# Altium schematic sheet ZUM_Core_Power.SchDoc: ZUM Core Power
size A4; Author: Andrés Gullón; DocumentNumber: 2; SheetNumber: 2; SheetTotal: 9
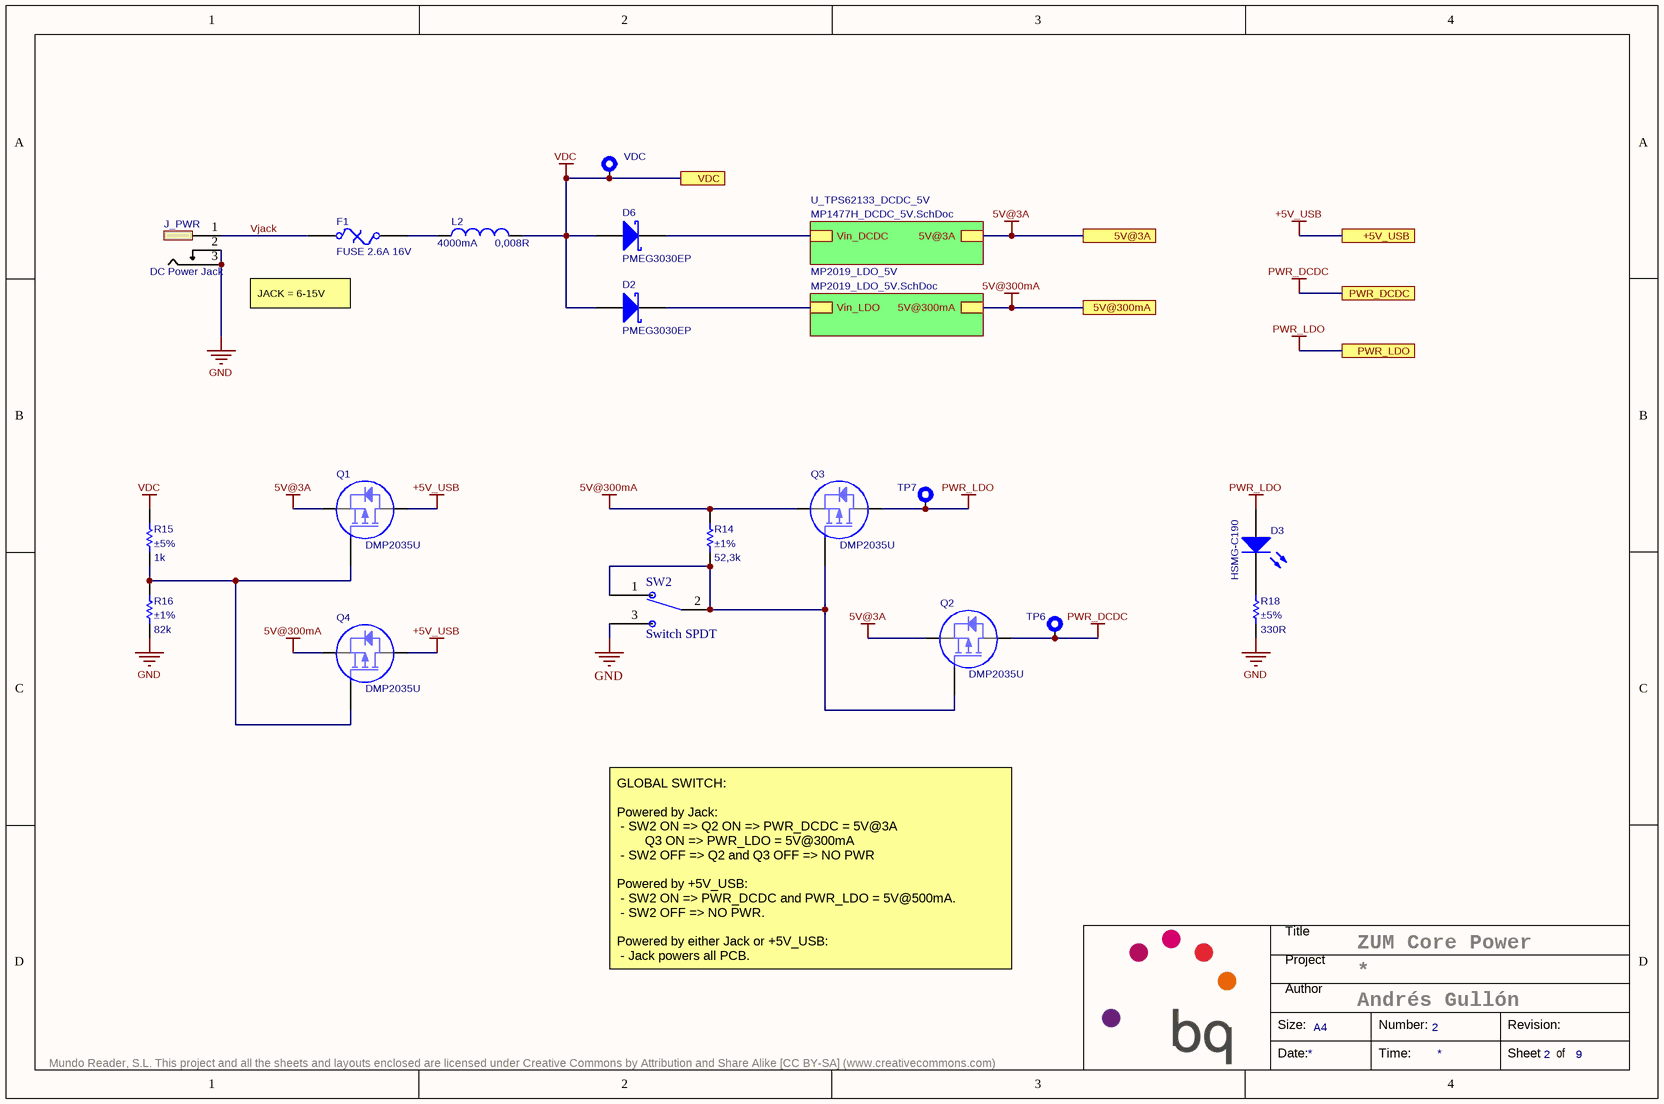
[diagram p0: ZUM_Core_Power.SchDoc]

## Parts
D2  PMEG3030EP  [SOD128]
D3  HSMG-C190  [LED0603]
D6  PMEG3030EP  [SOD128]
F1  FUSE 2.6A 16V  [F1812]
J_PWR  DC Power Jack  [Jack 2.1]
L2  Resistance_DC: 0,008R  Current: 4000mA  [L0805]  (hidden comment: L0805_33R_0,008R_4000mA)
Q1  DMP2035U  [SOT23-3]
Q2  DMP2035U  [SOT23-3]
Q3  DMP2035U  [SOT23-3]
Q4  DMP2035U  [SOT23-3]
R14  Tolerance: ±1%  Resistance: 52,3k  [R0402]  (hidden comment: R0402_52,3k_0.063W_±1%)
R15  Tolerance: ±5%  Resistance: 1k  [R0402]  (hidden comment: R0402_1k_0.063W_±5%)
R16  Tolerance: ±1%  Resistance: 82k  [R0402]  (hidden comment: R0402_82k_0.063W_±1%)
R18  Tolerance: ±5%  Resistance: 330R  [R0402]  (hidden comment: R0402_330R_0.063W_±5%)
SW2  Switch SPDT  [Slide SW SPDT Right Angle]
TP6  TP  [TP_POWER]  (value not drawn)  (no BOM)
TP7  TP  [TP_POWER]  (value not drawn)  (no BOM)
VDC  TP_POWER  [TP_POWER]  (value not drawn)  (no BOM)

## Sub-sheets
MP2019_LDO_5V = MP2019_LDO_5V.SchDoc: 5V@300mA, Vin_LDO
U_TPS62133_DCDC_5V = MP1477H_DCDC_5V.SchDoc: Vin_DCDC, 5V@3A

## Ports
5V@3A, 5V@300mA, +5V_USB, PWR_DCDC, PWR_LDO, VDC

## Nets
5V@3A: Q1.2(S) Q2.2(S) ; port 5V@3A, sheet U_TPS62133_DCDC_5V/5V@3A
5V@300mA: Q3.2(S) Q4.2(S) R14.1 ; port 5V@300mA, sheet MP2019_LDO_5V/5V@300mA
+5V_USB: Q1.3(D) Q4.3(D) ; port +5V_USB
GND: J_PWR.2 J_PWR.3 R16.1 R18.1 SW2.3
PWR_DCDC: Q2.3(D) TP6.1 ; port PWR_DCDC
PWR_LDO: D3.A Q3.3(D) TP7.1 ; port PWR_LDO
VDC: D2.A D6.A L2.2 R15.2 VDC.1 ; port VDC
Vjack: F1.1 J_PWR.1
NetD2_k: D2.k(K) ; sheet MP2019_LDO_5V/Vin_LDO
NetD3_K: D3.K R18.2
NetD6_k: D6.k(K) ; sheet U_TPS62133_DCDC_5V/Vin_DCDC
NetF1_2: F1.2 L2.1
NetQ1_1: Q1.1(G) Q4.1(G) R15.1 R16.2
NetQ2_1: Q2.1(G) Q3.1(G) R14.2 SW2.1 SW2.2

## Notes on the sheet
- JACK = 6-15V
- GLOBAL SWITCH:
  Powered by Jack:
  - SW2 ON => Q2 ON => PWR_DCDC = 5V@3A
  Q3 ON => PWR_LDO = 5V@300mA
  - SW2 OFF => Q2 and Q3 OFF => NO PWR
  Powered by +5V_USB:
  - SW2 ON => PWR_DCDC and PWR_LDO = 5V@500mA.
  - SW2 OFF => NO PWR.
  Powered by either Jack or +5V_USB:
  - Jack powers all PCB.
- Title
- Project
- Size:
- Author
- A4
- Number:
- Revision:
- Mundo Reader, S.L. This project and all the sheets and layouts enclosed are licensed under Creative Commons by Attribution and Share Alike [CC BY-SA] (www.creativecommons.com)
- Date:
- Time:
- Sheet
- of

## Library data of the parts
D2 D6 = CMP-A2309-1: Schottky Diode; Manufacturer: NXP; Ifor: 3A; Vrrm: 30V; Ifsm: 50A; Vf: 0,36V; Description ES: Diodo Schottky; Temp_Max: 150; Temp_Min: -55; Value: 3A 30V; SchLibComponentName: Schottky; Part Number: PMEG3030EP; OrderingCode: PMEG3030EP; Price units: EUR
D3 = CMP-A2544-1: LED; Manufacturer: Avago Technologies; Temp_ Max: 85; Temp_ Min: -40; OrderingCode 2: LG Q971-KN-1; Value: Green; SchLibComponentName: LED; Part Number: HSMG-C190; OrderingCode: HSMG-C190; Description ES: LED; Price units: EUR; Manufacturer 2: OSRAM Opto
F1 = CMP-A2427-2: Resettable Fuses; Part Number: FUSE 2.5A 16V; Manufacturer: Bel Fuse; SchLibComponentName: PTC_Fuse; Current: 2.5A; OrderingCode: 0ZCG0260BF2B; Description ES: Fusible reseteable; Temp_ Max: 85; Temp_ Min: -40; OrderingCode 2: MINISMDC260F/16-2; OrderingCode 3: MF-MSMF250/16X-2; Voltage: 16V; Price units: EUR; Manufacturer 2: Littelfuse; Manufacturer 3: Bourns
J_PWR = CMP-A2063-2: Connector; Manufacturer: Kycon; Idc: 5A; OrderingCode: KLDHCX0202A; Description ES: Conector; OrderingCode 2: RAPC722X; SchLibComponentName: Power_Jack; Part Number: DC Power Jack; Supplier cod: AC1190; Price units: EUR; Manufacturer 2: Switchcraft
L2 = CMP-A0714-1: Manufacturer: Würth Elektronik; SchLibComponentName: Ferrite Bead; Resistance_100MHz: 33R; OrderingCode: 742792012; Temp_ Max: 125; Temp_ Min: -55; Value: 33R 0,008R 4000mA; Part Number: L0805_33R_0,008R_4000mA; Price units: EUR
Q1-Q4 = CMP-A2378-1: P-MOSFET transistor; Manufacturer: Diodes Incorporated; SchLibComponentName: Mosfet_P; Vds: 20V; Vgss: 8V; Id: 3,6A; OrderingCode: DMP2035U-7; Description ES: Transistor MOSFET de canal P; Temp_ Max: 150; Temp_ Min: -55; Part Number: DMP2035U; Supplier cod: AC1190; Price units: EUR
R14 = CMP-A1961-1: Manufacturer: Vishay; Value: 52,3k ±1% 0.063W; OrderingCode: CRCW040252K3FK; Power: 0.063W; Temp_ Max: 155; Temp_ Min: -55; SchLibComponentName: Resistor; PackageDescription: SMD; Part Number: R0402_52,3k_0.063W_±1%; Price units: EUR
R15 = CMP-A1718-3: Manufacturer: Vishay; OrderingCode: CRCW04021K00JN; Power: 0.063W; Value: 1k ±5% 0.063W; Temp_ Max: 155; Temp_ Min: -55; Description ES: Resistencia; SchLibComponentName: Resistor; PackageDescription: SMD; Part Number: R0402_1k_0.063W_±5%; Price units: EUR
R16 = CMP-A1992-3: Manufacturer: Vishay; OrderingCode: CRCW040282K0FK; Power: 0.063W; Value: 82k ±1% 0.063W; Temp_ Max: 155; Temp_ Min: -55; Description ES: Resistencia; OrderingCode 2: RC0402FR-0782KL; SchLibComponentName: Resistor; PackageDescription: SMD; Part Number: R0402_82k_0.063W_±1%; Price units: EUR; Manufacturer 2: Yageo
R18 = CMP-A1762-2: Manufacturer: Vishay; SchLibComponentName: Resistor; OrderingCode: CRCW0402330RJN; Power: 0.063W; Value: 330R ±5% 0.063W; Temp_ Max: 155; Temp_ Min: -55; Description ES: Resistencia; PackageDescription: SMD; Part Number: R0402_330R_0.063W_±5%; Price: 0,003; Price units: EUR; Supplier: Abacus
SW2 = CMP-A2473-1: Switch; Manufacturer: Würth Elektronik; SchLibComponentName: SPDT Switch; OrderingCode: 450 302 014 072; Description ES: Micro interruptor; Temp_ Max: 85; Temp_ Min: -40; OrderingCode 2: MMP1010D-RA; Part Number: Switch SPDT; Supplier: Würth; Price units: EUR; Manufacturer 2: Knitter-Switch
TP6 TP7 VDC = CMP-A2499-3: Testpoint 0.3mm; Manufacturer: Oxley; OrderingCode: SMOX/060/B1; SAP: 303552; SchLibComponentName: Testpoint; Part Number: TP_POWER; Price units: EUR